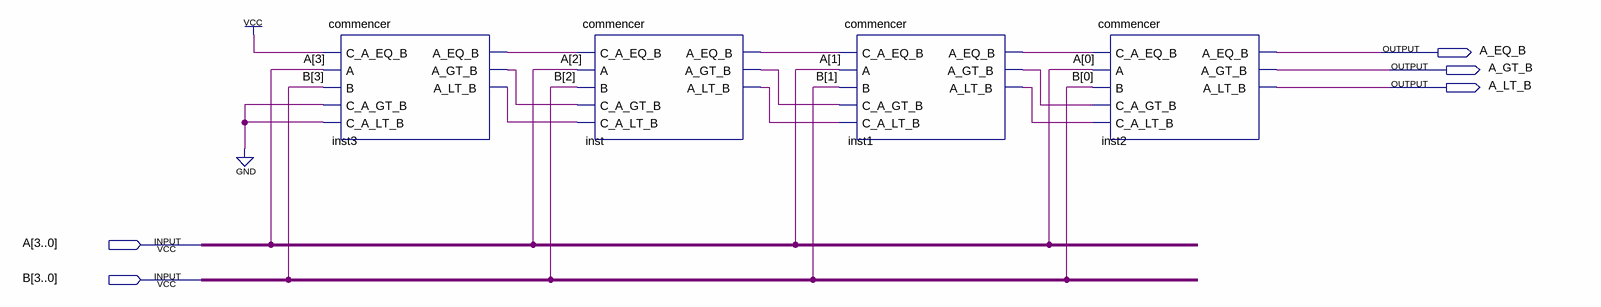
[diagram p0: schematic sheet]
// Quartus schematic comparador.bdf as structural Verilog: 4 symbols, 5 pins
module comparador (
  input  [3:0] A,
  input  [3:0] B,
  output A_EQ_B,
  output A_GT_B,
  output A_LT_B
);

  wire inst1_a_eq_b, inst1_a_gt_b, inst1_a_lt_b, inst3_a_eq_b, inst3_a_gt_b, inst3_a_lt_b, inst_a_eq_b,
       inst_a_gt_b, inst_a_lt_b;

  commencer inst3 (
    .C_A_EQ_B(1'b1), .A(A[3]), .B(B[3]), .C_A_GT_B(1'b0), .C_A_LT_B(1'b0), .A_EQ_B(inst3_a_eq_b),
    .A_GT_B(inst3_a_gt_b), .A_LT_B(inst3_a_lt_b));
  commencer inst (
    .C_A_EQ_B(inst3_a_eq_b), .A(A[2]), .B(B[2]), .C_A_GT_B(inst3_a_gt_b), .C_A_LT_B(inst3_a_lt_b),
    .A_EQ_B(inst_a_eq_b), .A_GT_B(inst_a_gt_b), .A_LT_B(inst_a_lt_b));
  commencer inst1 (
    .C_A_EQ_B(inst_a_eq_b), .A(A[1]), .B(B[1]), .C_A_GT_B(inst_a_gt_b), .C_A_LT_B(inst_a_lt_b),
    .A_EQ_B(inst1_a_eq_b), .A_GT_B(inst1_a_gt_b), .A_LT_B(inst1_a_lt_b));
  commencer inst2 (
    .C_A_EQ_B(inst1_a_eq_b), .A(A[0]), .B(B[0]), .C_A_GT_B(inst1_a_gt_b), .C_A_LT_B(inst1_a_lt_b),
    .A_EQ_B(A_EQ_B), .A_GT_B(A_GT_B), .A_LT_B(A_LT_B));
endmodule
